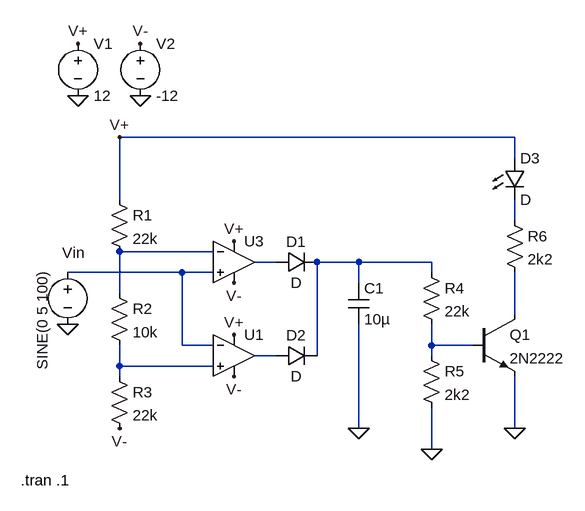
[diagram p0: schematic Peak_detector.asc]
Peak_detector.asc, the LTspice schematic file:
Version 4
SHEET 1 880 680
WIRE 640 -96 32 -96
WIRE 640 -64 640 -96
WIRE 32 0 32 -96
WIRE 640 32 640 0
WIRE 176 80 32 80
WIRE 272 96 240 96
WIRE 400 96 336 96
WIRE 512 96 400 96
WIRE 128 112 -48 112
WIRE 176 112 128 112
WIRE 512 112 512 96
WIRE 400 128 400 96
WIRE 32 144 32 80
WIRE 640 176 640 112
WIRE 128 224 128 112
WIRE 176 224 128 224
WIRE 512 224 512 192
WIRE 576 224 512 224
WIRE 272 240 240 240
WIRE 336 240 336 96
WIRE 512 240 512 224
WIRE 32 256 32 224
WIRE 176 256 32 256
WIRE 32 272 32 256
WIRE 400 352 400 192
WIRE 640 352 640 272
WIRE 512 384 512 320
FLAG -32 -160 0
FLAG 64 -160 0
FLAG -32 -240 V+
FLAG 64 -240 V-
FLAG 208 128 V-
FLAG 208 272 V-
FLAG 208 64 V+
FLAG 208 208 V+
FLAG -48 192 0
FLAG 32 352 V-
FLAG 640 352 0
FLAG 512 384 0
FLAG 400 352 0
FLAG 32 -96 V+
SYMBOL voltage -32 -256 R0
WINDOW 123 0 0 Left 0
WINDOW 39 0 0 Left 0
SYMATTR InstName V1
SYMATTR Value 12
SYMBOL voltage 64 -256 R0
WINDOW 123 0 0 Left 0
WINDOW 39 0 0 Left 0
SYMATTR InstName V2
SYMATTR Value -12
SYMBOL voltage -48 96 R0
WINDOW 3 -39 13 VRight 2
WINDOW 123 0 0 Left 0
WINDOW 39 0 0 Left 0
WINDOW 0 -8 -14 Left 2
SYMATTR Value SINE(0 5 100)
SYMATTR InstName Vin
SYMBOL res 16 -16 R0
SYMATTR InstName R1
SYMATTR Value 22k
SYMBOL res 16 128 R0
SYMATTR InstName R2
SYMATTR Value 10k
SYMBOL res 16 256 R0
SYMATTR InstName R3
SYMATTR Value 22k
SYMBOL diode 272 112 R270
WINDOW 0 32 32 VTop 2
WINDOW 3 0 32 VBottom 2
SYMATTR InstName D1
SYMBOL diode 272 256 R270
WINDOW 0 32 32 VTop 2
WINDOW 3 0 32 VBottom 2
SYMATTR InstName D2
SYMBOL cap 384 128 R0
SYMATTR InstName C1
SYMATTR Value 10µ
SYMBOL res 496 96 R0
SYMATTR InstName R4
SYMATTR Value 22k
SYMBOL res 496 224 R0
SYMATTR InstName R5
SYMATTR Value 2k2
SYMBOL npn 576 176 R0
SYMATTR InstName Q1
SYMATTR Value 2N2222
SYMBOL res 624 16 R0
SYMATTR InstName R6
SYMATTR Value 2k2
SYMBOL LED 624 -64 R0
SYMATTR InstName D3
SYMBOL OpAmps\\UniversalOpAmp2 208 96 R0
SYMATTR InstName U3
SYMBOL OpAmps\\UniversalOpAmp2 208 240 R0
SYMATTR InstName U1
TEXT -120 432 Left 2 !.tran .1

The netlist it stands for:
* Peak_detector.asc
V1 V+ 0 12
V2 V- 0 -12
Vin N005 0 SINE(0 5 100)
R1 V+ N002 22k
R2 N002 N009 10k
R3 N009 V- 22k
D1 N003 N004 D
D2 N008 N004 D
C1 N004 0 10µ
R4 N004 N007 22k
R5 N007 0 2k2
Q1 N006 N007 0 0 2N2222
R6 N001 N006 2k2
D3 V+ N001 D
XU3 N005 N002 V+ V- N003 level2 Avol=1Meg GBW=10Meg Slew=10Meg Ilimit=25m Rail=0 Vos=0 En=0 Enk=0 In=0 Ink=0 Rin=500Meg  ; pins In+ In- V+ V- OUT
XU1 N009 N005 V+ V- N008 level2 Avol=1Meg GBW=10Meg Slew=10Meg Ilimit=25m Rail=0 Vos=0 En=0 Enk=0 In=0 Ink=0 Rin=500Meg  ; pins In+ In- V+ V- OUT
.model D D
.lib standard.dio
.model NPN NPN
.model PNP PNP
.lib standard.bjt
.tran .1
.lib UniversalOpAmp2.lib
.backanno
.end